# Altium schematic sheet cSLIM_nRF9160.SchDoc: TEST
size A3; SheetNumber: 2
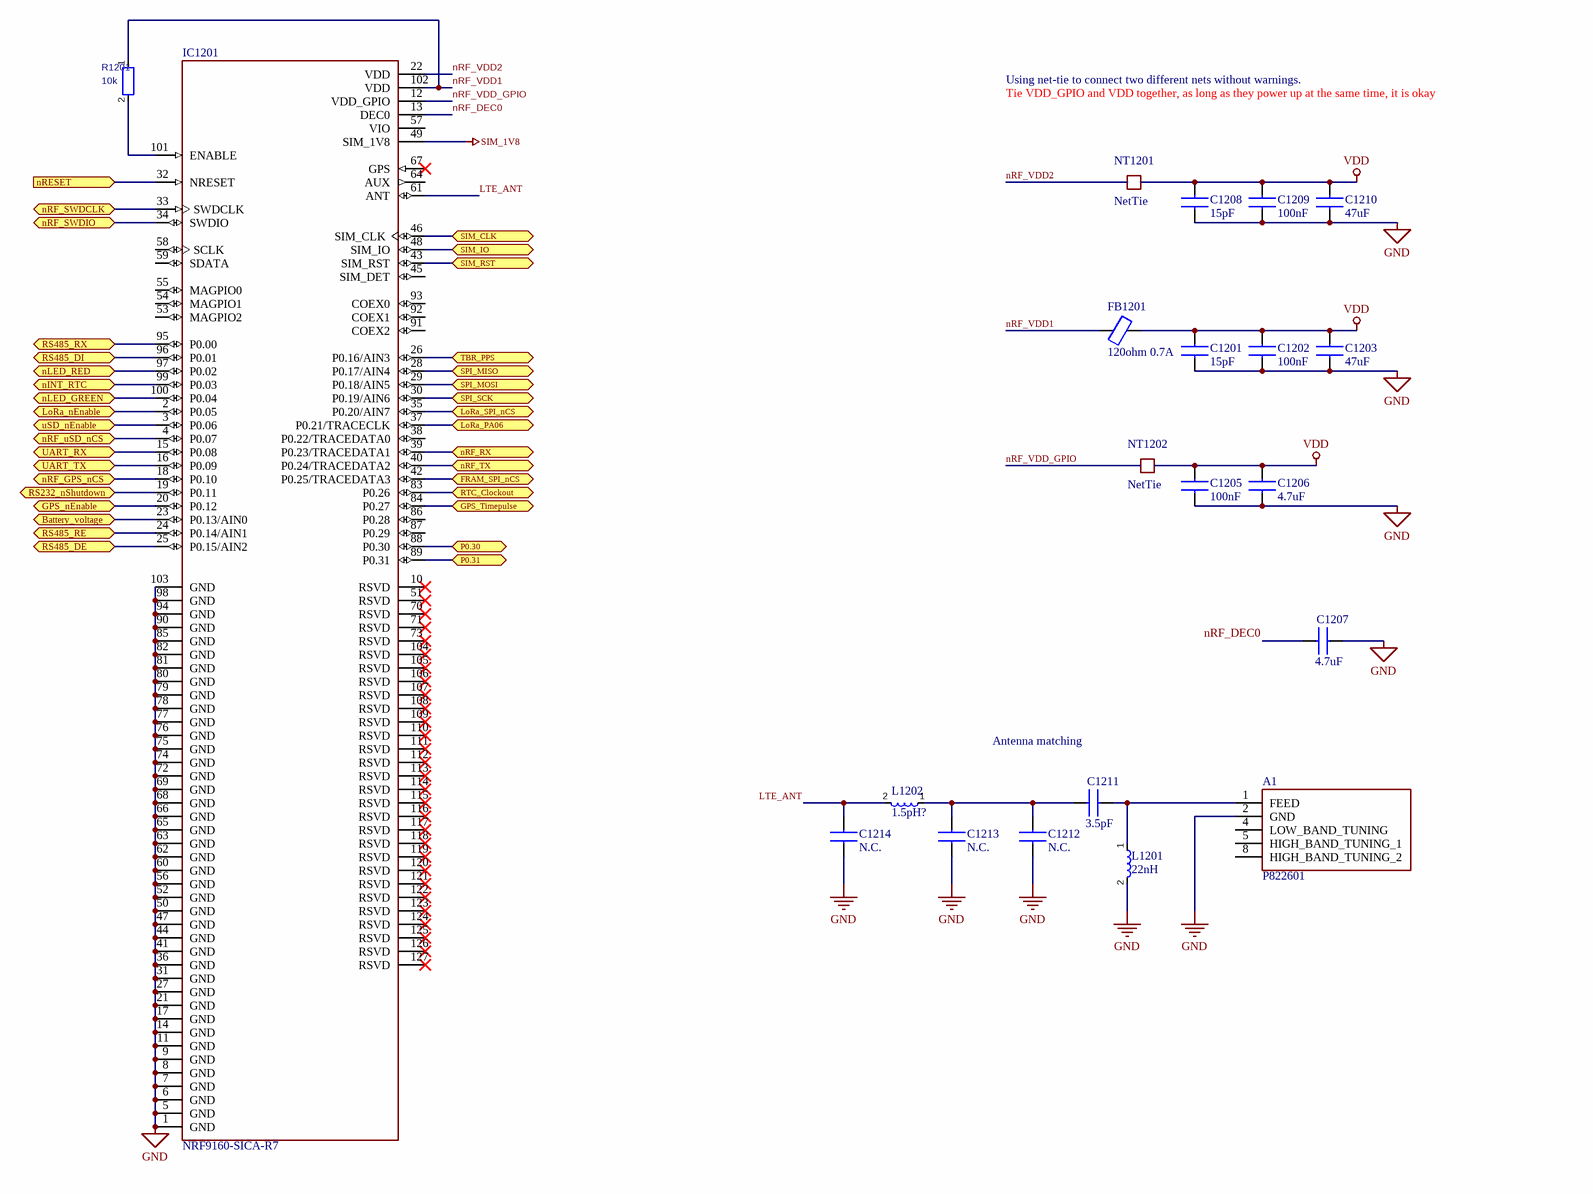
[diagram p0: cSLIM_nRF9160.SchDoc]

## Parts
A1  P822601  [P822601]
C1201  15pF  [CAPC1608X90N]
C1202  100nF  [CAPC1608X90N]
C1203  47uF  [CAPC1608X90N]
C1205  100nF  [CAPC1608X90N]
C1206  4.7uF  [CAPC1608X90N]
C1207  4.7uF  [CAPC1608X90N]
C1208  15pF  [CAPC1608X90N]
C1209  100nF  [CAPC1608X90N]
C1210  47uF  [CAPC1608X90N]
C1211  3.5pF  [CAPC1608X90N]
C1212  N.C.  [CAPC1608X90N]
C1213  N.C.  [CAPC1608X90N]
C1214  N.C.  [CAPC1608X90N]
FB1201  120ohm 0.7A  [CAPC1608X90N]
IC1201  NRF9160-SICA-R7  [XCVR_NRF9160-SICA-R7]
L1201  22nH  [L-1608]
L1202  1.5pH?  [L-1608]
NT1201  NetTie  [NETTIE_FP]
NT1202  NetTie  [NETTIE_FP]
R1201  10k  [RESC1608X55N]

## Ports
Battery_voltage (bidir), FRAM_SPI_nCS (bidir), GPS_nEnable (bidir), GPS_Timepulse (bidir), LoRa_nEnable (bidir), LoRa_PA06 (bidir), LoRa_SPI_nCS (bidir), nINT_RTC (bidir), nLED_GREEN (bidir), nLED_RED (bidir), nRESET (in), nRF_GPS_nCS (bidir), nRF_RX (bidir), nRF_SWDCLK (bidir), nRF_SWDIO (bidir), nRF_TX (bidir), nRF_uSD_nCS (bidir), P0.30 (bidir), P0.31 (bidir), RS232_nShutdown (bidir), RS485_DE (bidir), RS485_DI (bidir), RS485_RE (bidir), RS485_RX (bidir), RTC_Clockout (bidir), SIM_CLK (bidir), SIM_IO (bidir), SIM_RST (bidir), SPI_MISO (bidir), SPI_MOSI (bidir), SPI_SCK (bidir), TBR_PPS (bidir), UART_RX (bidir), UART_TX (bidir), uSD_nEnable (bidir)

## Nets
GND: A1.2(GND) C1201.2 C1202.2 C1203.2 C1205.2 C1206.2 C1207.2 C1208.2 C1209.2 C1210.2 C1212.2 C1213.2 C1214.2 IC1201.1(GND) IC1201.5(GND) IC1201.6(GND) IC1201.7(GND) IC1201.8(GND) IC1201.9(GND) IC1201.11(GND) IC1201.14(GND) IC1201.17(GND) IC1201.21(GND) IC1201.27(GND) IC1201.31(GND) IC1201.36(GND) IC1201.41(GND) IC1201.44(GND) IC1201.47(GND) IC1201.50(GND) IC1201.52(GND) IC1201.56(GND) IC1201.60(GND) IC1201.62(GND) IC1201.63(GND) IC1201.65(GND) IC1201.66(GND) IC1201.68(GND) IC1201.69(GND) IC1201.72(GND) IC1201.74(GND) IC1201.75(GND) IC1201.76(GND) IC1201.77(GND) IC1201.78(GND) IC1201.79(GND) IC1201.80(GND) IC1201.81(GND) IC1201.82(GND) IC1201.85(GND) IC1201.90(GND) IC1201.94(GND) IC1201.98(GND) IC1201.103(GND) L1201.2
SIM_1V8: IC1201.49(SIM_1V8)
VDD: C1201.1 C1202.1 C1203.1 C1205.1 C1206.1 C1208.1 C1209.1 C1210.1 FB1201.2 NT1201.2 NT1202.2
Battery_voltage: IC1201.23(P0.13/AIN0) ; port Battery_voltage
FRAM_SPI_nCS: IC1201.42(P0.25/TRACEDATA3) ; port FRAM_SPI_nCS
GPS_nEnable: IC1201.20(P0.12) ; port GPS_nEnable
GPS_Timepulse: IC1201.84(P0.27) ; port GPS_Timepulse
LoRa_nEnable: IC1201.2(P0.05) ; port LoRa_nEnable
LoRa_PA06: IC1201.37(P0.21/TRACECLK) ; port LoRa_PA06
LoRa_SPI_nCS: IC1201.35(P0.20/AIN7) ; port LoRa_SPI_nCS
LTE_ANT: C1214.1 IC1201.61(ANT) L1202.2
nINT_RTC: IC1201.99(P0.03) ; port nINT_RTC
nLED_GREEN: IC1201.100(P0.04) ; port nLED_GREEN
nLED_RED: IC1201.97(P0.02) ; port nLED_RED
nRESET: IC1201.32(NRESET) ; port nRESET
nRF_DEC0: C1207.1 IC1201.13(DEC0)
nRF_GPS_nCS: IC1201.18(P0.10) ; port nRF_GPS_nCS
nRF_RX: IC1201.39(P0.23/TRACEDATA1) ; port nRF_RX
nRF_SWDCLK: IC1201.33(SWDCLK) ; port nRF_SWDCLK
nRF_SWDIO: IC1201.34(SWDIO) ; port nRF_SWDIO
nRF_TX: IC1201.40(P0.24/TRACEDATA2) ; port nRF_TX
nRF_uSD_nCS: IC1201.4(P0.07) ; port nRF_uSD_nCS
nRF_VDD1: FB1201.1 IC1201.102(VDD) R1201.1
nRF_VDD2: IC1201.22(VDD) NT1201.1
nRF_VDD_GPIO: IC1201.12(VDD_GPIO) NT1202.1
P0.30: IC1201.88(P0.30) ; port P0.30
P0.31: IC1201.89(P0.31) ; port P0.31
RS232_nShutdown: IC1201.19(P0.11) ; port RS232_nShutdown
RS485_DE: IC1201.25(P0.15/AIN2) ; port RS485_DE
RS485_DI: IC1201.96(P0.01) ; port RS485_DI
RS485_RE: IC1201.24(P0.14/AIN1) ; port RS485_RE
RS485_RX: IC1201.95(P0.00) ; port RS485_RX
RTC_Clockout: IC1201.83(P0.26) ; port RTC_Clockout
SIM_CLK: IC1201.46(SIM_CLK) ; port SIM_CLK
SIM_IO: IC1201.48(SIM_IO) ; port SIM_IO
SIM_RST: IC1201.43(SIM_RST) ; port SIM_RST
SPI_MISO: IC1201.28(P0.17/AIN4) ; port SPI_MISO
SPI_MOSI: IC1201.29(P0.18/AIN5) ; port SPI_MOSI
SPI_SCK: IC1201.30(P0.19/AIN6) ; port SPI_SCK
TBR_PPS: IC1201.26(P0.16/AIN3) ; port TBR_PPS
UART_RX: IC1201.15(P0.08) ; port UART_RX
UART_TX: IC1201.16(P0.09) ; port UART_TX
uSD_nEnable: IC1201.3(P0.06) ; port uSD_nEnable
NetA1_1: A1.1(FEED) C1211.2 L1201.1
NetC1211_1: C1211.1 C1212.1 C1213.1 L1202.1
NetIC1201_101: IC1201.101(ENABLE) R1201.2

Not connected (* = marked no-connect by the designer): A1 4(LOW_BAND_TUNING) 5(HIGH_BAND_TUNING_1) 8(HIGH_BAND_TUNING_2); IC1201 10(RSVD)* 38(P0.22/TRACEDATA0) 45(SIM_DET) 51(RSVD)* 53(MAGPIO2) 54(MAGPIO1) 55(MAGPIO0) 57(VIO) 58(SCLK) 59(SDATA) 64(AUX) 67(GPS)* 70(RSVD)* 71(RSVD)* 73(RSVD)* 86(P0.28) 87(P0.29) 91(COEX2) 92(COEX1) 93(COEX0) 104(RSVD)* 105(RSVD)* 106(RSVD)* 107(RSVD)* 108(RSVD)* 109(RSVD)* 110(RSVD)* 111(RSVD)* 112(RSVD)* 113(RSVD)* 114(RSVD)* 115(RSVD)* 116(RSVD)* 117(RSVD)* 118(RSVD)* 119(RSVD)* 120(RSVD)* 121(RSVD)* 122(RSVD)* 123(RSVD)* 124(RSVD)* 125(RSVD)* 126(RSVD)* 127(RSVD)*

## Notes on the sheet
- Tie VDD_GPIO and VDD together, as long as they power up at the same time, it is okay
- Using net-tie to connect two different nets without warnings.
- Antenna matching

## Library data of the parts
A1 = P822601: Antenna; Manufacturer_Name: AVX; Datasheet Link: http://datasheets.avx.com/ethertronics/AVX-E_P822601-P822602.pdf; Height: 3.5mm; Manufacturer_Part_Number: P822601; Mouser Part Number: 581-P822601; Mouser Price/Stock: https://www.mouser.co.uk/ProductDetail/AVX/P822601?qs=vdi0iO8H4N0igrTLYxGIXg%3D%3D; Arrow Part Number: P822601; Arrow Price/Stock: https://www.arrow.com/en/products/p822601/avx?region=nac
C1201-C1203 C1205-C1214 = C: Capacitor; Manufacturer_Name: AVX; Manufacturer_Part_Number: 06033G104ZAT2A; Datasheet Link: http://www.mouser.com/catalog/supplier/library/pdf/AVXSurfaceMountCeramic.pdf; Height: 0.9mm; Mouser Part Number: 581-06033G104Z; Mouser Price/Stock: https://www.mouser.co.uk/ProductDetail/AVX/06033G104ZAT2A?qs=NXubJDmysXJMPmHfVo6Z%252BA%3D%3D; Arrow Part Number: 06033G104ZAT2A; Arrow Price/Stock: https://www.arrow.com/en/products/06033g104zat2a/avx?region=nac
FB1201 = Ferrite_Bead
IC1201 = NRF9160-SICA-R7: IC RF TxRx + MCU Cellular GPS 700MHz ~ 2.2GHz 161-TFLGA Module; MF: Nordic Semiconductor ASA; Purchase-URL: https://pricing.snapeda.com/search/part/NRF9160-SICA-R7/?ref=eda; Availability: Good; Price: None; Package: Module Nordic Semiconductor ASA; Value: *; SnapEDA_Link: https://www.snapeda.com/parts/NRF9160-SICA-R7/Nordic%20Semiconductor%20ASA/view-part/3660917/?ref=snap; MP: NRF9160-SICA-R7
L1201 L1202 = L
R1201 = R